# EAGLE design ReceiverPCB (EAGLE 8.3.2)
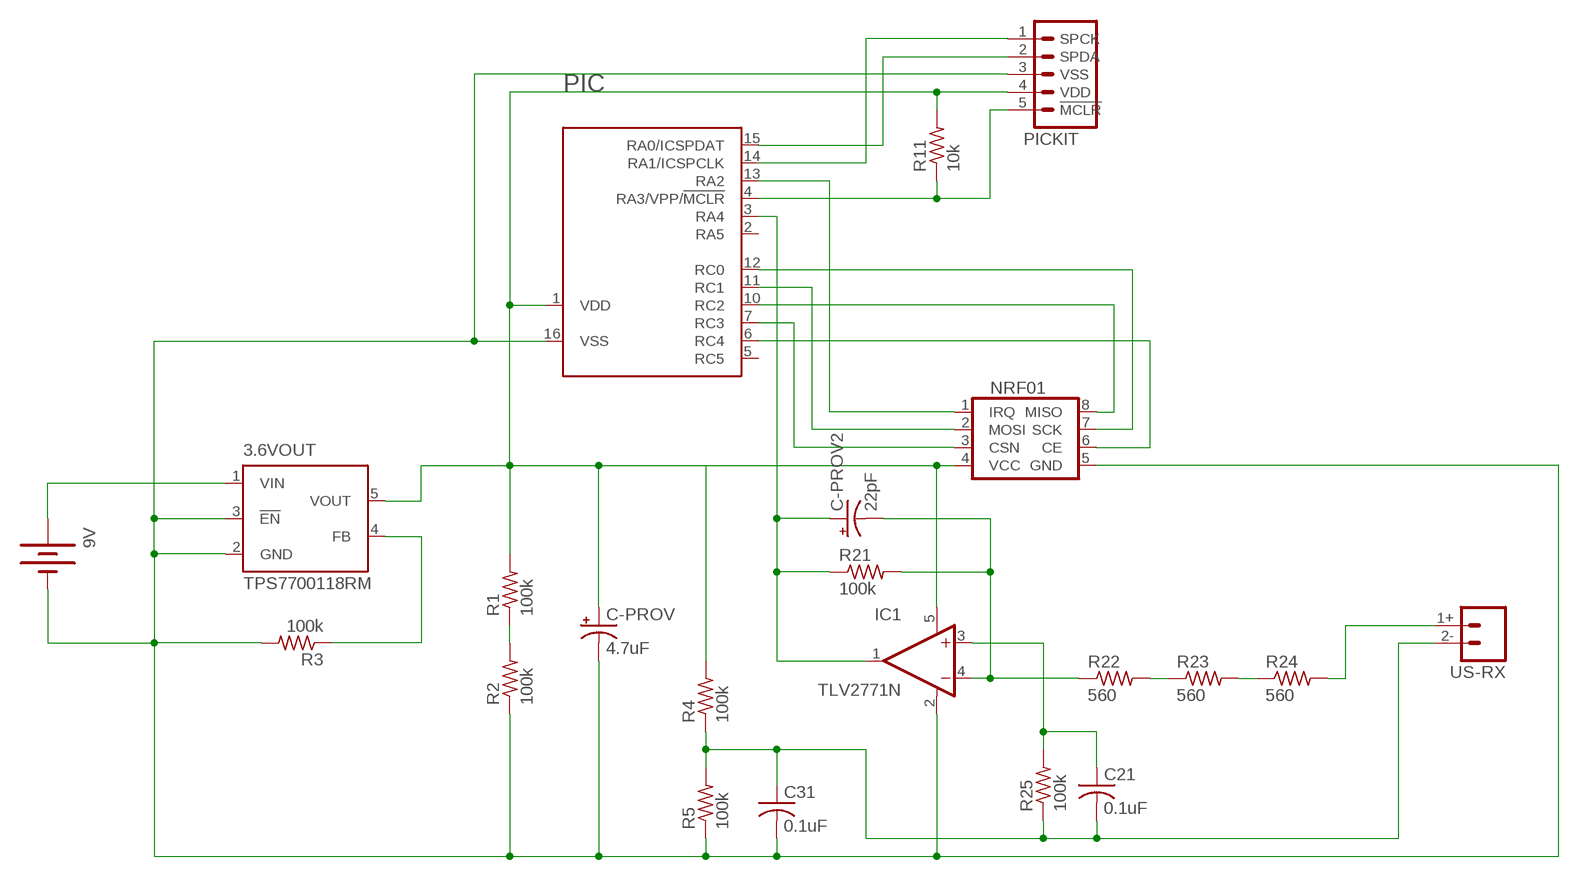
[diagram p0: schematic, sheet 1]

## Parts
3.6VOUT  TPS7700118RM  [SOT23-5L]
9V  BATTERY9V  [BATTCON_9V]
C21  0.1uF  C-USC0805  [C0805]
C31  0.1uF  C-USC0805  [C0805]
C-PROV  4.7uF  CPOL-USE2,5-6E  [E2,5-6E]
C-PROV2  22pF  CPOL-USE2,5-6E  [E2,5-6E]
IC1  TLV2771N  [SOT23-5]
NRF01  NRF01  [JP4Q]
PIC  PIC16F1503(DIL16)  [DIL16]
PICKIT  M05PTH  [1X05]
R1  100k  R-US_R0805  [R0805]
R2  100k  R-US_R0805  [R0805]
R3  100k  R-US_R0805  [R0805]
R4  100k  R-US_R0805  [R0805]
R5  100k  R-US_R0805  [R0805]
R11  10k  R-US_R0805  [R0805]
R21  100k  R-US_R0805  [R0805]
R22  560  R-US_R0805  [R0805]
R23  560  R-US_R0805  [R0805]
R24  560  R-US_R0805  [R0805]
R25  100k  R-US_R0805  [R0805]
US-RX  M02UT-1640K-TT-2-R  [ULTRASONIC-PEIZO]

## Nets
N$1: PIC.14(RA1/ICSPCLK) PICKIT.1(SPCK)
N$2: PIC.15(RA0/ICSPDAT) PICKIT.2(SPDA)
N$3: R1.1 R2.2
N$4: 3.6VOUT.5(VOUT) C-PROV.+ IC1.5(V+) NRF01.4(VCC) PIC.1(VDD) PICKIT.4(VDD) R1.2 R4.2 R11.2
N$5: NRF01.1(IRQ) PIC.13(RA2)
N$6: PIC.4(RA3/VPP/!MCLR) PICKIT.5(!MCLR) R11.1
N$7: NRF01.2(MOSI) PIC.11(RC1)
N$8: NRF01.3(CSN) PIC.7(RC3)
N$9: NRF01.8(MISO) PIC.10(RC2)
N$10: NRF01.7(SCK) PIC.12(RC0)
N$11: NRF01.6(CE) PIC.6(RC4)
N$12: 3.6VOUT.2(GND) 3.6VOUT.3(!EN) 9V.- C31.2 C-PROV.- IC1.2(V-) NRF01.5(GND) PIC.16(VSS) PICKIT.3(VSS) R2.1 R3.2 R5.1
N$13: 3.6VOUT.4(FB) R3.1
N$14: 3.6VOUT.1(VIN) 9V.+
N$15: C-PROV2.+ IC1.1(OUT) PIC.3(RA4) R21.1
N$17: R24.2 US-RX.1+
N$18: R22.2 R23.1
N$19: R23.2 R24.1
N$20: C-PROV2.- IC1.4(-IN) R21.2 R22.1
N$21: C21.2 C31.1 R4.1 R5.2 R25.1 US-RX.2-
N$22: C21.1 IC1.3(+IN) R25.2
Unconnected: PIC.2(RA5) PIC.5(RC5)

## Library data of the parts
3.6VOUT = gac_lib:TPS77001: Ultra low drop and low noise BiCMOS voltage regulators Source: www.st.com LD3985.pdf
9V = SparkFun-Electromechanical:BATTERY: Battery Holders Various common sizes : AA, AAA, 18650 (PRT-12895), 20mm coin cell and 12mm coin cell. 20MM_4LEGS, BATT-10373
C21 C31 = resistor:C-US: CAPACITOR, American symbol
C-PROV C-PROV2 = rcl:CPOL-US: POLARIZED CAPACITOR, American symbol
IC1 = gac_lib:TLV2771: Operational Amplifiers Single-Supply, MicroAmplifier(TM) Series; MF: TEXAS INSTRUMENTS; MPN: OPA237NA/250; OC_FARNELL: 4625298; OC_NEWARK: 35C1874
NRF01 = gac_lib:NRF01: JUMPER
PIC = gac_lib:PIC16F1503(DIL16)
PICKIT = gac_lib:M05: Header 5 Standard 5-pin 0.1" header. Use with straight break away headers (SKU : PRT-00116), right angle break away headers (PRT-00553), swiss pins (PRT-00743), machine pins (PRT-00117), and female headers (PRT-00115). Molex polarized connector foot print use with SKU : PRT-08230 with associated crimp pins and housings.
R1-R5 R11 R21-R25 = resistor:R-US_: RESISTOR, American symbol
US-RX = gac_lib:M02: Standard 2-pin 0.1" header. Use with - straight break away headers ( PRT-00116) - right angle break away headers (PRT-00553) - swiss pins (PRT-00743) - machine pins (PRT-00117) - female headers (PRT-00115) Molex polarized connector foot print use with: PRT-08233 with associated crimp pins and housings. 2.54_SCREWTERM for use with PRT-10571. 3.5mm Screw Terminal footprints for PRT-08084 5mm Screw Terminal footprints for use with PRT-08432

## Board
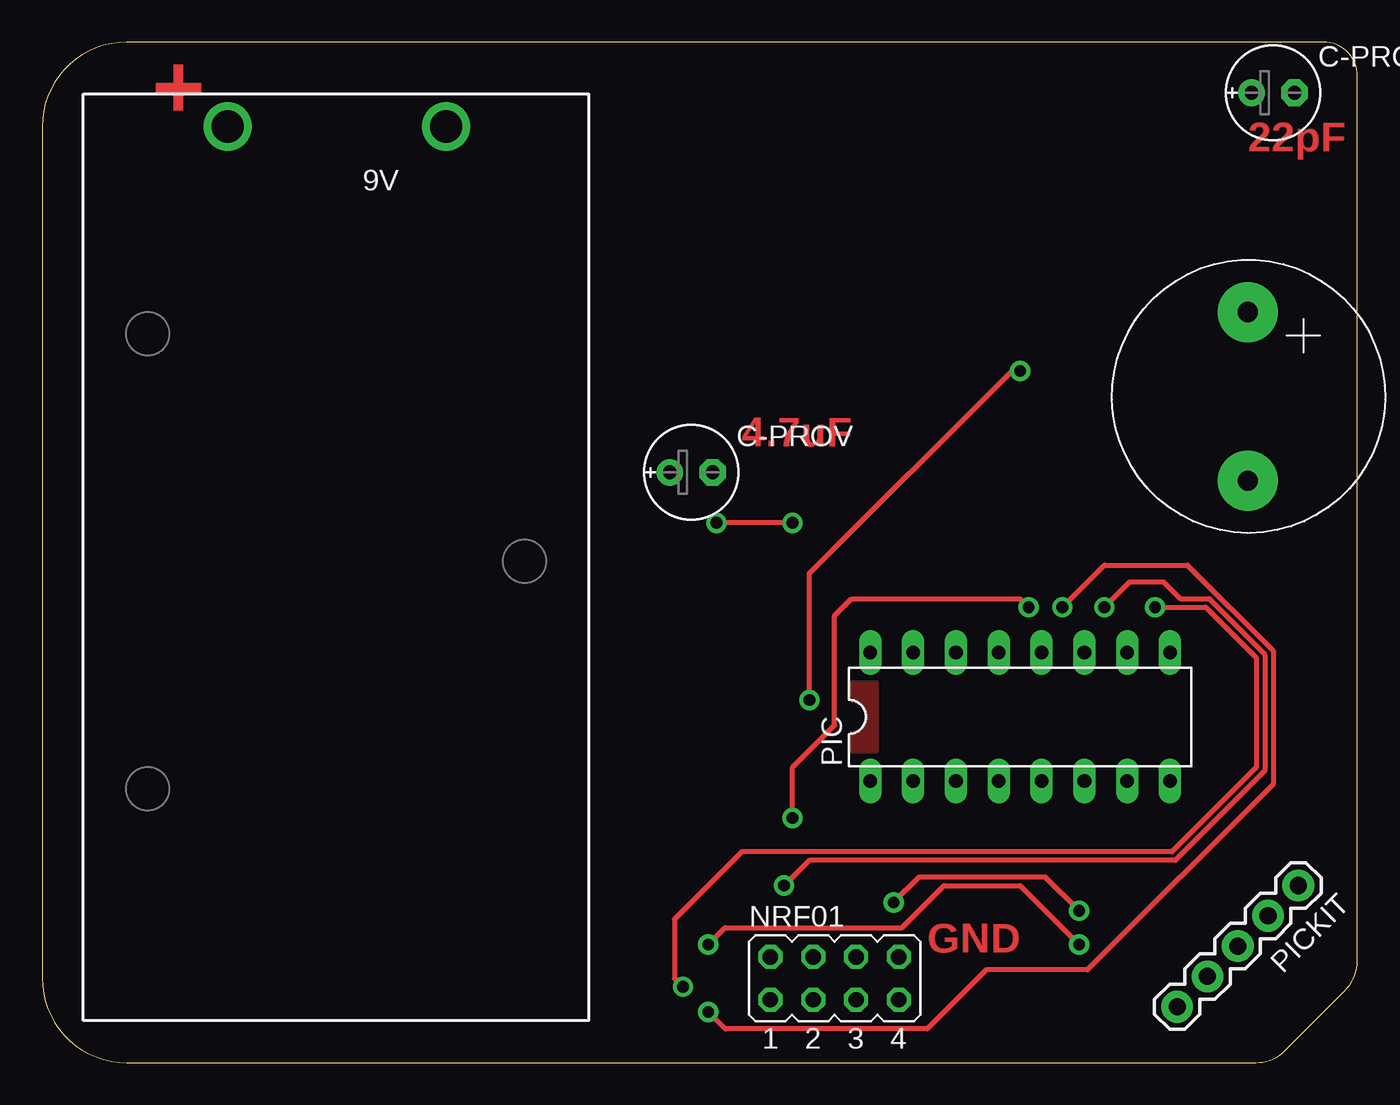
[diagram p1: board, top side]
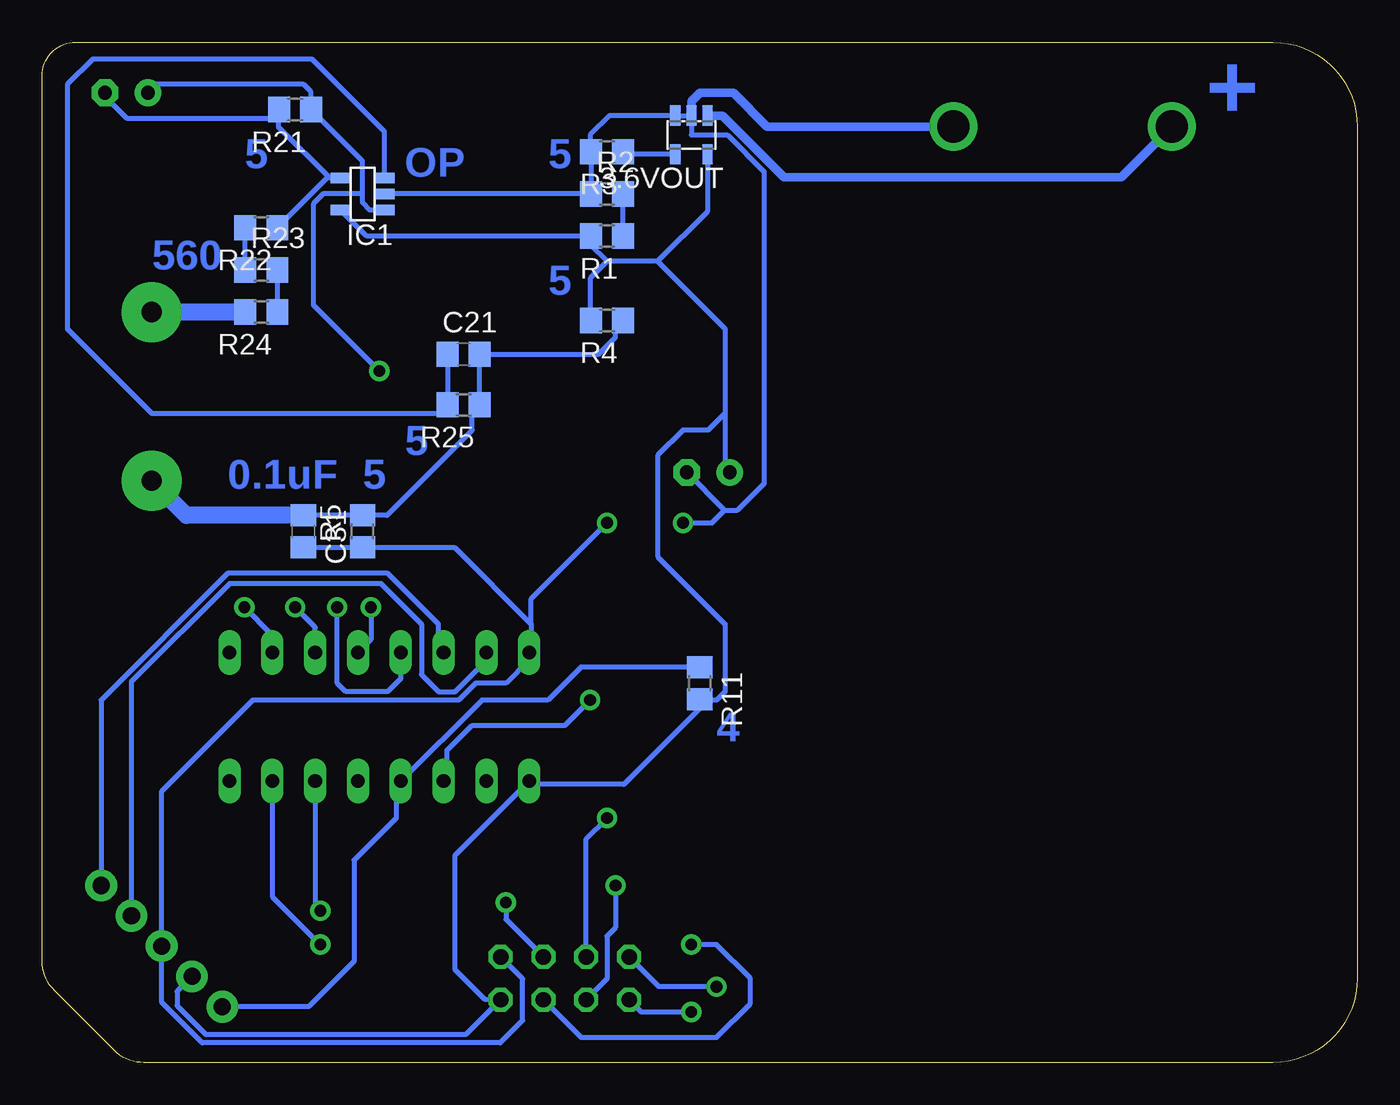
[diagram p2: board, bottom side, seen from below]

Size 78 x 60.5 mm. Coordinates in mm from the lower left corner, seen from the top.
Outline: 5,0 71.96,0 arc45 73.73,0.73 77.27,4.27 arc45 78,6.04 78,58.5 arc90 76,60.5 5,60.5 arc90 0,55.5 0,5 arc90 5,0
Copper layers (1*16): Top 0.035mm / dielectric 1.5mm / Bottom 0.035mm
Design rules "default *": minimum track width 6mil, minimum drill 0.35mm, track to track 0.2mm, track to pad 0.2mm, pad to pad 6mil, via to via 6mil, smd to smd 6mil, copper to edge 40mil, drill to drill 6mil, minimum pad ring 10mil, minimum via ring 8mil, stop-mask expansion 4mil, vias tented up to drill 0mil, thermal gap 10mil

### Footprints (pad centres in the part's own frame; a part is rotated, then mirrored left to right if it is on the bottom)
SOT23-5L = smd 0.6 x 1.2: 1 -0.95,-1.15; 2 0,-1.15; 3 0.95,-1.15; 4 0.95,1.15; 5 -0.95,1.15
BATTCON_9V = drill 1.905: + 0,0; - 0,-12.954
C0805 = smd 1.3 x 1.5: 1 -0.95,0; 2 0.95,0
E2,5-6E = drill 0.813 pad 1.575: + -1.27,0 | drill 0.813 pad 1.575 octagon: - 1.27,0
SOT23-5 = smd 0.6 x 1.2: 1 -0.95,-1.306; 2 0,-1.306; 3 0.95,-1.306; 4 0.95,1.306; 5 -0.95,1.306
JP4Q = drill 0.914 octagon: 1 -3.81,-1.27; 2 -1.27,-1.27; 3 1.27,-1.27; 4 3.81,-1.27; 5 3.81,1.27; 6 1.27,1.27; 7 -1.27,1.27; 8 -3.81,1.27
DIL16 = drill 0.813 long: 1 -8.89,-3.81; 2 -6.35,-3.81; 3 -3.81,-3.81; 4 -1.27,-3.81; 5 1.27,-3.81; 6 3.81,-3.81; 7 6.35,-3.81; 8 8.89,-3.81; 9 8.89,3.81; 10 6.35,3.81; 11 3.81,3.81; 12 1.27,3.81; 13 -1.27,3.81; 14 -3.81,3.81; 15 -6.35,3.81; 16 -8.89,3.81
1X05 = drill 1.016 pad 1.88: 1 0,0; 2 2.54,0; 3 5.08,0; 4 7.62,0; 5 10.16,0
R0805 = smd 1.3 x 1.5: 1 -0.95,0; 2 0.95,0
ULTRASONIC-PEIZO = drill 1.2 pad 3.556: 1+ -5,0; 2- 5,0

### Placement (x,y rotation side)
3.6VOUT  39.5,55 180 bottom
9V  11,55.5 90 top
C21  53,42 0 bottom
C31  62.5,31.5 270 bottom
C-PROV  38.5,35 0 top
C-PROV2  73,57.5 0 top
IC1  59,51.5 90 bottom
NRF01  47,5 0 top
PIC  58,20.5 0 top
PICKIT  74.5,10.5 225 top
R1  44.5,49 180 bottom
R2  44.5,51.5 0 bottom
R3  44.5,54 180 bottom
R4  44.5,44 180 bottom
R5  59,31.5 90 bottom
R11  39,22.5 270 bottom
R21  63,56.5 180 bottom
R22  65,49.5 180 bottom
R23  65,47 0 bottom
R24  65,44.5 180 bottom
R25  53,39 180 bottom
US-RX  71.5,39.5 270 top

### Tracks (layer width: path | path; a pad name or v marks a point on that pad's centre or on a via)
N$1
  Bottom 0.305: PIC.14 54.5,24.62 54.5,26 57.5,29 67,29 74.5,21.5 PICKIT.1
N$2
  Bottom 0.305: PIC.15 52,23.96 52,23.5 53.5,22 54.5,22 55.5,23 55.5,26 57.89,28.39 66.89,28.39 72.7,22.58 PICKIT.2
N$3
  Bottom 0.305: R1.1 R2.2
N$4
  Bottom 0.305: 3.6VOUT.5 38.55,50.45 41.5,47.5 | 41.5,47.5 44.5,47.5 | 44.5,47.5 45.5,48.5 45.5,48.95 R1.2 58.76,49 IC1.5 | R4.2 45.5,44.05 45.5,46.5 44.5,47.5 | 37.5,38.5 37.5,43.5 41.5,47.5 | 37.5,38.5 37.5,35.27 C-PROV.+ | 37.5,38.5 38.5,37.5 40,37.5 41.5,36 41.5,30 37.5,26 37.5,22 38,21.5 38.95,21.5 R11.2 39,21 43.5,16.5 48.92,16.5 PIC.1 53.5,12.3 53.5,5.5 51.73,3.73 NRF01.4 52.52,2.02 | 52.52,2.02 52.54,2 | PICKIT.4 70,4.22 70,3.38 68.29,1.67 52.87,1.67 52.52,2.02
N$5  (via drill 0.7 pad 1.2)
  Top 0.305: v60.5,27 63,29.5 67.93,29.5 73.01,24.42 73.01,16.51 62,5.5 56,5.5 52.5,2 40.5,2 v39.5,3
  Bottom 0.305: PIC.13 56.73,22.77 57.5,22 60,22 60.5,22.5 v60.5,27 | v39.5,3 42.46,3 NRF01.1
N$6
  Bottom 0.305: R11.1 46.05,23.45 48,21.5 51.92,21.5 PIC.4 57,16.42 57,14.5 59.5,12 59.5,6 62.18,3.32 PICKIT.5
N$7  (via drill 0.7 pad 1.2)
  Top 0.305: v44,10.5 45.49,11.99 67.21,11.99 72.5,17.29 72.5,24.21 69.21,27.5 67.5,27.5 66.5,28.5 64.5,28.5 v63,27
  Bottom 0.305: PIC.11 61.81,25.81 v63,27 | v44,10.5 44,8 44.5,7.5 44.5,4.96 NRF01.2
N$8  (via drill 0.7 pad 1.2)
  Top 0.305: v39.5,7 40.5,8 51,8 53.49,10.49 58.01,10.49 v61.5,7
  Bottom 0.305: PIC.7 64.35,9.85 v61.5,7 | NRF01.3 46.04,1.5 38,1.5 36,3.5 36,5 38,7 v39.5,7
N$9  (via drill 0.7 pad 1.2)
  Top 0.305: v66,27 69,27 72,24 72,17.5 67,12.5 41.5,12.5 37.5,8.5 37.5,5 v38,4.5
  Bottom 0.305: PIC.10 64.35,25.35 v66,27 | 42.46,5.54 42.42,5.5 | 42.46,5.54 NRF01.8 | v38,4.5 41.42,4.5 42.46,5.54
N$10  (via drill 0.7 pad 1.2)
  Top 0.305: v44.5,14.5 44.5,17.5 47,20 47,26.5 48,27.5 58,27.5 v58.5,27
  Bottom 0.305: NRF01.7 45.73,13.27 v44.5,14.5 | 59.04,24.54 PIC.12 | 59.04,24.54 58.7,24.88 | v58.5,27 58.5,25.08 59.04,24.54
N$11  (via drill 0.7 pad 1.2)
  Top 0.305: v61.5,9 59.5,11 52,11 v50.5,9.5
  Bottom 0.305: PIC.6 61.81,9.31 v61.5,9 | v50.5,9.5 50.5,8.5 NRF01.6
N$12  (via drill 0.7 pad 1.2)
  Top 0.305: v44.5,32 v40,32
  Bottom 0.305: IC1.2 R2.1 R3.2 45.5,54.05 45.5,55 44.35,56.15 3.6VOUT.3 3.6VOUT.2 39.5,55 37.36,55 35.18,52.82 35.18,34.32 36.75,32.75 37.52,32.75 | 37.52,32.75 C-PROV.- | C31.2 R5.1 53.55,30.55 49,26 | 49,26 49,24.42 PIC.16 49.11,23.89 50.5,22.5 52.29,22.5 53.29,21.5 65.5,21.5 70.91,16.09 70.91,7 | 49,26 49,27.5 v44.5,32 | v40,32 38.27,32 37.52,32.75 | NRF01.5 49.5,4.96 49.5,2.5 50.83,1.17 68.5,1.17 70.91,3.58 70.91,7 | 70.91,7 PICKIT.3
  Bottom 0.508: 9V.- 35,55.5 37,57.5 39,57.5 39.5,57 3.6VOUT.2
N$13
  Bottom 0.305: 3.6VOUT.4 43.4,53.85 R3.1
N$14
  Bottom 0.508: 3.6VOUT.1 37.65,56.15 34,52.5 14,52.5 9V.+
N$15  (via drill 0.7 pad 1.2)
  Top 0.305: v58,41 57.5,41 45.5,29 v45.5,21.5
  Bottom 0.305: IC1.1 58.55,50.55 59,51 59,51.5 | 59,51.5 59,53.45 R21.1 62.05,57.55 62.5,58 71.23,58 C-PROV2.+ | 59,51.5 61.34,51.5 61.92,50.92 61.92,44.92 v58,41 | PIC.3 54,16.88 54,18.5 52.5,20 47,20 v45.5,21.5
N$16
  pour Top: 48,22.5 48,21.5 arc-90 49,20.5 arc-90 48,19.5 48,18.5 49.5,18.5 49.5,22.5
N$17
  Bottom 1.016: R24.2 US-RX.1+
N$18
  Bottom 0.305: R23.1 R22.2
N$19
  Bottom 0.305: R23.2 64.05,45.05 64,45 64,44.55 R24.1
N$20
  Bottom 0.305: IC1.4 60.95,52.45 | 60.95,52.45 64,55.5 64,56.45 | 64,56.45 R21.2 | C-PROV2.- 74.27,57.27 73,56 64.45,56 64,56.45 | 60.95,52.45 61.1,52.45 R22.1
N$21
  Bottom 0.305: R4.1 44,43.55 44,43 45,42 C21.2 R25.1 52.5,38.55 52.5,37.5 57.55,32.45 R5.2 C31.1
  Bottom 1.016: C31.1 69.45,32.45 US-RX.2-
N$22
  Bottom 0.305: IC1.3 57.69,55.19 62,59.5 75,59.5 76.5,58 76.5,43.5 71.5,38.5 54.45,38.5 R25.2 C21.1

### Text on the board
Top: + | 22pF | 4.7uF | GND
Bottom: + | 5 | 5 | OP | 560 | 5 | 5 | 5 | 0.1uF | 4